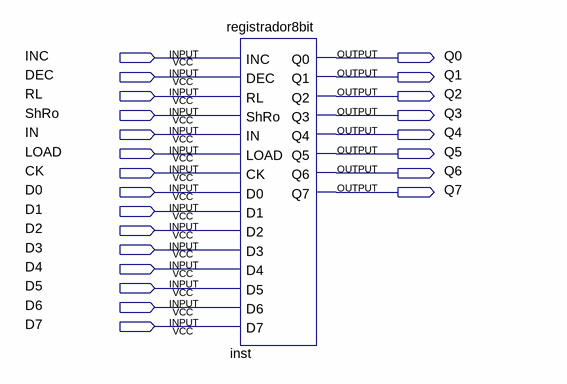
[diagram p0: schematic sheet]
// Quartus schematic main.bdf as structural Verilog: 1 symbols, 23 pins
module main (
  input  INC,
  input  DEC,
  input  RL,
  input  ShRo,
  input  IN,
  input  LOAD,
  input  CK,
  input  D0,
  input  D1,
  input  D2,
  input  D3,
  input  D4,
  input  D5,
  input  D6,
  input  D7,
  output Q0,
  output Q1,
  output Q2,
  output Q3,
  output Q4,
  output Q5,
  output Q6,
  output Q7
);

  registrador8bit inst (
    .INC(INC), .DEC(DEC), .RL(RL), .ShRo(ShRo), .IN(IN), .LOAD(LOAD), .CK(CK), .D0(D0), .D1(D1), .D2(D2),
    .D3(D3), .D4(D4), .D5(D5), .D6(D6), .D7(D7), .Q0(Q0), .Q1(Q1), .Q2(Q2), .Q3(Q3), .Q4(Q4), .Q5(Q5),
    .Q6(Q6), .Q7(Q7));
endmodule
